# Altium schematic sheet PCB.SchDoc
size A4; PageSetup: Record=PageOptions|CenterHorizontal=True|CenterVertical=True|PrintScale=1.00|XCorrection=1.00|YCorrection=1.00|PrintKind=0|BorderSize=5000000|LeftOffset=0|BottomOffset=0|Orientation=2|PaperLength=1000|PaperWidth=1000|Scale=100|PaperSource=7|PrintQuality=-3|MediaType=1|DitherType=10|PrintScaleMode=1|PaperKind=A4|PaperIndex=9
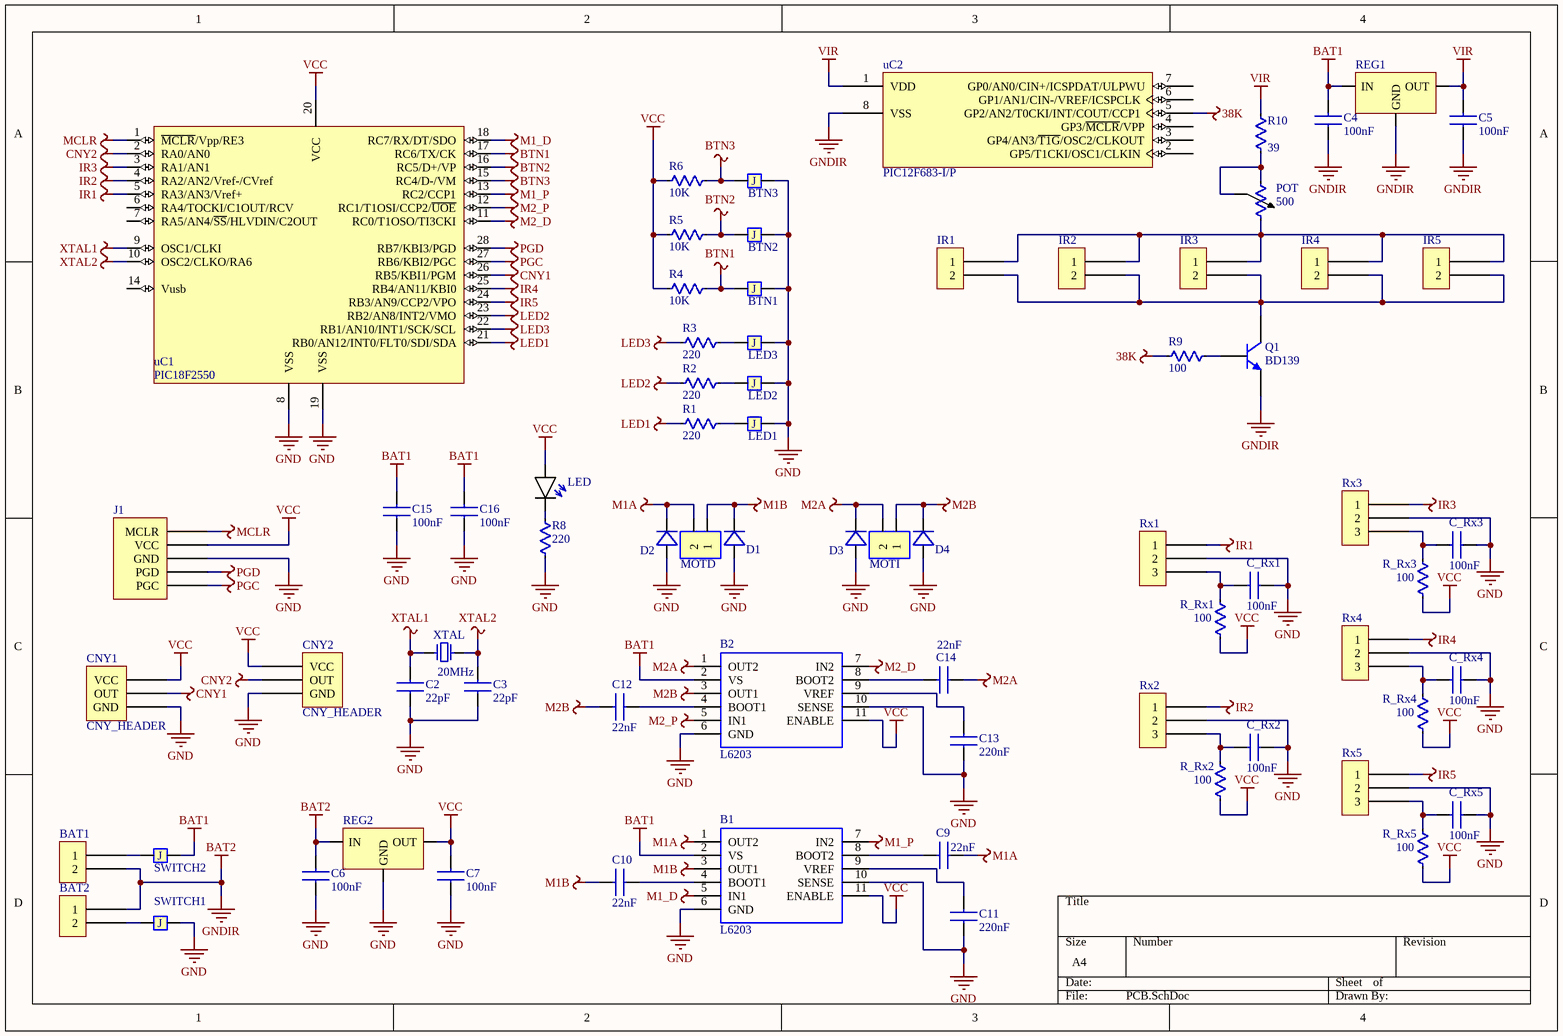
[diagram p0: PCB.SchDoc]

## Parts
B1  L6203  [MUTIWATT11]
B2  L6203  [MUTIWATT11]
BAT1  (no value)  [HEADER 1x2]
BAT2  (no value)  [HEADER 1x2]
BTN1  JUMPER  [JUMPER]  (value not drawn)
BTN2  JUMPER  [JUMPER]  (value not drawn)
BTN3  JUMPER  [JUMPER]  (value not drawn)
C2  value 22pF  [CAP-CER]  (hidden comment: CAP-CER)
C3  value 22pF  [CAP-CER]  (hidden comment: CAP-CER)
C4  value 100nF  [CAP-CER]  (hidden comment: CAP-CER)
C5  value 100nF  [CAP-CER]  (hidden comment: CAP-CER)
C6  value 100nF  [CAP-CER]  (hidden comment: CAP-CER)
C7  value 100nF  [CAP-CER]  (hidden comment: CAP-CER)
C9  value 22nF  [CAP-CER]  (hidden comment: CAP-CER)
C10  value 22nF  [CAP-CER]  (hidden comment: CAP-CER)
C11  value 220nF  [CAP-CER]  (hidden comment: CAP-CER)
C12  value 22nF  [CAP-CER]  (hidden comment: CAP-CER)
C13  value 220nF  [CAP-CER]  (hidden comment: CAP-CER)
C14  value 22nF  [CAP-CER]  (hidden comment: CAP-CER)
C15  value 100nF  [CAP-CER]  (hidden comment: CAP-CER)
C16  value 100nF  [CAP-CER]  (hidden comment: CAP-CER)
C_Rx1  value 100nF  [CAP-CER]  (hidden comment: CAP-CER)
C_Rx2  value 100nF  [CAP-CER]  (hidden comment: CAP-CER)
C_Rx3  value 100nF  [CAP-CER]  (hidden comment: CAP-CER)
C_Rx4  value 100nF  [CAP-CER]  (hidden comment: CAP-CER)
C_Rx5  value 100nF  [CAP-CER]  (hidden comment: CAP-CER)
CNY1  CNY_HEADER  [CNY_HEADER]
CNY2  CNY_HEADER  [CNY_HEADER]
D1  DIODE  [DO-41]  (value not drawn)
D2  DIODE  [DO-41]  (value not drawn)
D3  DIODE  [DO-41]  (value not drawn)
D4  DIODE  [DO-41]  (value not drawn)
IR1  (no value)  [HEADER 1x2]
IR2  (no value)  [HEADER 1x2]
IR3  (no value)  [HEADER 1x2]
IR4  (no value)  [HEADER 1x2]
IR5  (no value)  [HEADER 1x2]
J1  (no value)  [Header 1x5]
LED  LED  [LED-3MM-RED]  (value not drawn)
LED1  JUMPER  [JUMPER]  (value not drawn)
LED2  JUMPER  [JUMPER]  (value not drawn)
LED3  JUMPER  [JUMPER]  (value not drawn)
MOTD  2-BLOCK_TERMINAL  [BLOCK_TERMINAL-2]  (value not drawn)
MOTI  2-BLOCK_TERMINAL  [BLOCK_TERMINAL-2]  (value not drawn)
POT  value 500  [POT-10TURN]  (hidden comment: POT)
Q1  BD139  [TO-126]
R1  value 220  [RES-Axial-400mil]  (hidden comment: RES)
R2  value 220  [RES-Axial-400mil]  (hidden comment: RES)
R3  value 220  [RES-Axial-400mil]  (hidden comment: RES)
R4  value 10K  [RES-Axial-400mil]  (hidden comment: RES)
R5  value 10K  [RES-Axial-400mil]  (hidden comment: RES)
R6  value 10K  [RES-Axial-400mil]  (hidden comment: RES)
R8  value 220  [RES-Axial-400mil]  (hidden comment: RES)
R9  value 100  [RES-Axial-400mil]  (hidden comment: RES)
R10  value 39  [RES-Axial-400mil]
R_Rx1  value 100  [RES-Axial-400mil]  (hidden comment: RES)
R_Rx2  value 100  [RES-Axial-400mil]  (hidden comment: RES)
R_Rx3  value 100  [RES-Axial-400mil]  (hidden comment: RES)
R_Rx4  value 100  [RES-Axial-400mil]  (hidden comment: RES)
R_Rx5  value 100  [RES-Axial-400mil]  (hidden comment: RES)
REG1  LM7805  [TO-220-FLAT]  (value not drawn)
REG2  LM7805  [TO-220-FLAT]  (value not drawn)
Rx1  Header 1x3  [Header 1x3]  (value not drawn)
Rx2  Header 1x3  [Header 1x3]  (value not drawn)
Rx3  Header 1x3  [Header 1x3]  (value not drawn)
Rx4  Header 1x3  [Header 1x3]  (value not drawn)
Rx5  Header 1x3  [Header 1x3]  (value not drawn)
SWITCH1  JUMPER  [JUMPER]  (value not drawn)
SWITCH2  JUMPER  [JUMPER]  (value not drawn)
uC1  PIC18F2550  [DIP28]
uC2  PIC12F683-I/P  [PDIP300-P8]
XTAL  FREQUENCY: 20MHz  [CRYSTAL-TH]

## Nets
38K: R9.1 uC2.5(GP2/AN2/T0CKI/INT/COUT/CCP1)
BAT1: B1.2(VS) B2.2(VS) C4.2 C15.2 C16.2 REG1.1(IN) SWITCH2.1
BAT2: BAT1.2 BAT2.1 C4.1 C5.1 C6.2 Q1.E REG1.2(GND) REG2.1(IN) uC2.8(VSS)  [also labelled GNDIR]
BTN1: BTN1.1 R4.1 uC1.17(RC6/TX/CK)
BTN2: BTN2.1 R5.1 uC1.16(RC5/D+/VP)
BTN3: BTN3.2 R6.2 uC1.15(RC4/D-/VM)
CNY1: CNY1.3(OUT) uC1.26(RB5/KBI1/PGM)
CNY2: CNY2.3(OUT) uC1.2(RA0/AN0)
GND: B1.6(GND) B1.10(SENSE) B2.6(GND) B2.10(SENSE) BTN1.2 BTN2.2 BTN3.1 C2.1 C3.1 C6.1 C7.1 C11.1 C13.1 C15.1 C16.1 C_Rx1.2 C_Rx2.2 C_Rx3.2 C_Rx4.2 C_Rx5.2 CNY1.1(GND) CNY2.1(GND) D1.A D2.A D3.A D4.A J1.3(GND) LED1.2 LED2.2 LED3.2 R8.1 REG2.2(GND) Rx1.2 Rx2.2 Rx3.2 Rx4.2 Rx5.2 SWITCH1.1 uC1.8(VSS) uC1.19(VSS)
IR1: Rx1.1 uC1.5(RA3/AN3/Vref+)
IR2: Rx2.1 uC1.4(RA2/AN2/Vref-/CVref)
IR3: Rx3.1 uC1.3(RA1/AN1)
IR4: Rx4.1 uC1.25(RB4/AN11/KBI0)
IR5: Rx5.1 uC1.24(RB3/AN9/CCP2/VPO)
LED1: R1.2 uC1.21(RB0/AN12/INT0/FLT0/SDI/SDA)
LED2: R2.2 uC1.23(RB2/AN8/INT2/VMO)
LED3: R3.2 uC1.22(RB1/AN10/INT1/SCK/SCL)
M1_D: B1.5(IN1) uC1.18(RC7/RX/DT/SDO)
M1_P: B1.7(IN2) uC1.13(RC2/CCP1)
M1A: B1.1(OUT2) C9.2 D2.K MOTD.2
M1B: B1.3(OUT1) C10.1 D1.K MOTD.1
M2_D: B2.7(IN2) uC1.11(RC0/T1OSO/TI3CKI)
M2_P: B2.5(IN1) uC1.12(RC1/T1OSI/CCP2/~{UOE})
M2A: B2.1(OUT2) C14.2 D3.K MOTI.2
M2B: B2.3(OUT1) C12.1 D4.K MOTI.1
MCLR: J1.1(MCLR) uC1.1(~{MCLR}/Vpp/RE3)
PGC: J1.5(PGC) uC1.27(RB6/KBI2/PGC)
PGD: J1.4(PGD) uC1.28(RB7/KBI3/PGD)
VCC: B1.11(ENABLE) B2.11(ENABLE) C7.2 CNY1.2(VCC) CNY2.2(VCC) J1.2(VCC) LED.A R4.2 R5.2 R6.1 R_Rx1.1 R_Rx2.1 R_Rx3.1 R_Rx4.1 R_Rx5.1 REG2.3(OUT) uC1.20(VCC)
VIR: C5.2 R10.2 REG1.3(OUT) uC2.1(VDD)
XTAL1: C2.2 uC1.9(OSC1/CLKI) XTAL.1
XTAL2: C3.2 uC1.10(OSC2/CLKO/RA6) XTAL.2
NetB1_4: B1.4(BOOT1) C10.2
NetB1_8: B1.8(BOOT2) C9.1
NetB1_9: B1.9(VREF) C11.2
NetB2_4: B2.4(BOOT1) C12.2
NetB2_8: B2.8(BOOT2) C14.1
NetB2_9: B2.9(VREF) C13.2
NetBAT1_1: BAT1.1 SWITCH2.2
NetBAT2_2: BAT2.2 SWITCH1.2
NetC_Rx1_1: C_Rx1.1 R_Rx1.2 Rx1.3
NetC_Rx2_1: C_Rx2.1 R_Rx2.2 Rx2.3
NetC_Rx3_1: C_Rx3.1 R_Rx3.2 Rx3.3
NetC_Rx4_1: C_Rx4.1 R_Rx4.2 Rx4.3
NetC_Rx5_1: C_Rx5.1 R_Rx5.2 Rx5.3
NetIR1_1: IR1.1 IR2.1 IR3.1 IR4.1 IR5.1 POT.1
NetIR1_2: IR1.2 IR2.2 IR3.2 IR4.2 IR5.2 Q1.C
NetLED1_1: LED1.1 R1.1
NetLED2_1: LED2.1 R2.1
NetLED3_1: LED3.1 R3.1
NetLED_K: LED.K R8.2
NetPOT_2: POT.2 POT.3 R10.1
NetQ1_B: Q1.B R9.2

Not connected (* = marked no-connect by the designer): uC1 6(RA4/TOCKI/C1OUT/RCV) 7(RA5/AN4/~{SS}/HLVDIN/C2OUT) 14(Vusb); uC2 2(GP5/T1CKI/OSC1/CLKIN) 3(GP4/AN3/~{T1G}/OSC2/CLKOUT) 4(GP3/~{MCLR}/VPP) 6(GP1/AN1/CIN-/VREF/ICSPCLK) 7(GP0/AN0/CIN+/ICSPDAT/ULPWU)

## Notes on the sheet
- (in symbol JUMPER) J

## Library data of the parts
B1 B2 = L6203: DC motor controller,L6203 0-48V STMicroelectronics L6203, Motor Controller Full Bridge Motor,, 11-Pin MULTIWATT V; Geometry.Height: 5mm; Arrow Part Number: L6203; Manufacturer_Name: STMicroelectronics; Manufacturer_Part_Number: L6203; Datasheet Link: https://www.arrow.com/en/products/l6203/stmicroelectronics
BAT1 BAT2 IR1-IR5 = Header 1x2
D1-D4 = DIODE: NAME: 1N4007
J1 = Header Programmer
Q1 = NPN: pin to pad: B>3 C>2 E>1
R10 = RES
REG1 REG2 = LM78XX
uC2 = PIC12F683-I/P: Flash-Based 8-Bit CMOS Microcontroller with nanoWatt Technology, 2K (x14-Bit words) Program Memory, 384 Bytes Data Memory, 8-Pin PDIP, Industrial Temperature; Published: 29-Jan-2009; LatestRevisionDate: 02-Dec-2009; LatestRevisionNote: Updated to datasheet revision revD, Feb-2007.; DatasheetVersion: revD, Feb-2007; PackageVersion: revBB, Aug-2009; PackageReference: PDIP300-P8; Publisher: Altium Limited; PackageDescription: 8-Lead Plastic Dual In-Line (P) - 300 mil Body [PDIP]; Supplier 1: Digi-Key; Supplier Part Number 1: PIC12F683-I/P-ND; Supplier 2: Farnell; Supplier Part Number 2: 9759034; Supplier 3: Farnell; Supplier Part Number 3: 1523923; Code_JEDEC: MS-001; ComponentLink1Description: Datasheet; ComponentLink1URL: http://ww1.microchip.com/downloads/en/DeviceDoc/41211D_.pdf; ComponentLink2Description: Packaging Specification; ComponentLink2URL: http://www.microchip.com/stellent/groups/techpub_sg/documents/packagingspec/en012702.pdf; ComponentLink3Description: Microchip.com Home; ComponentLink3URL: http://www.microchip.com/
XTAL = XTAL